# Altium schematic sheet SIT1051 CAN bus.SchDoc
size A4; SheetNumber: 12; SheetTotal: 12
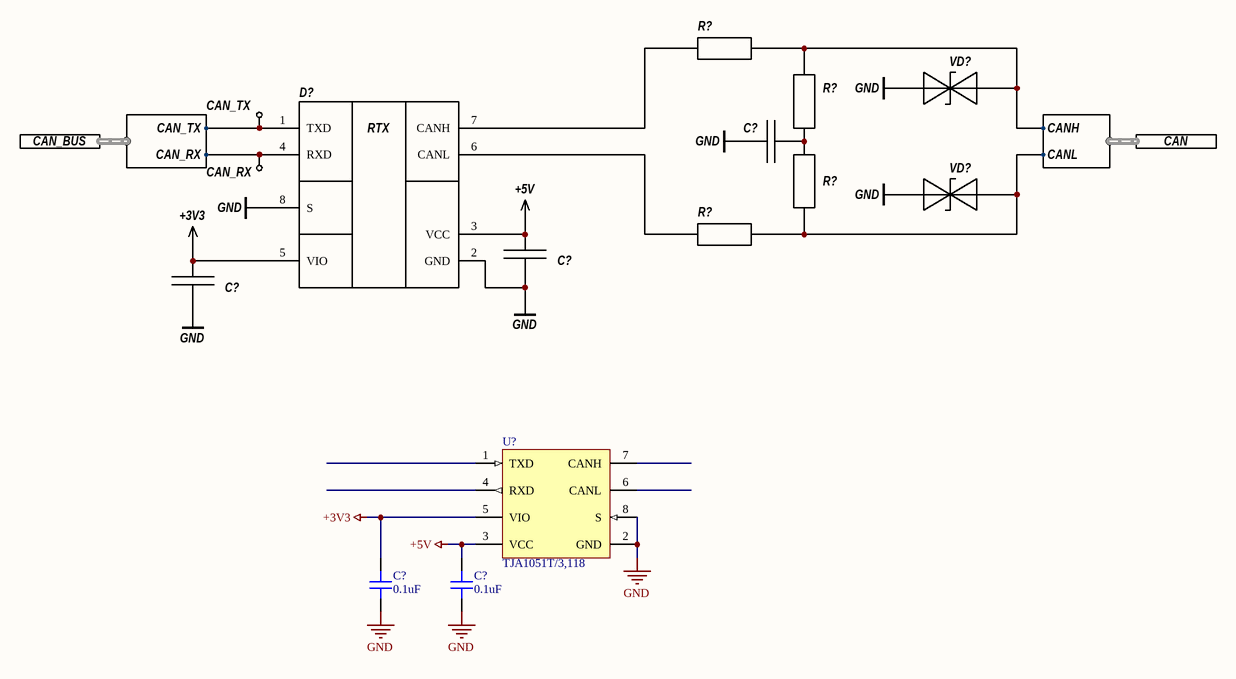
[diagram p0: SIT1051 CAN bus.SchDoc]

## Parts
(Parts that share a designator on the sheet are numbered #1, #2 ... from top to bottom, then left to right.)
C?#1  0.1uF  [C_0402]  (value not drawn)
C?#2  0.1uF  [C_0402]  (value not drawn)
C?#3  0.1uF  [C_0402]  (value not drawn)
C?#4  0.1uF  [CAPC1005X06N]
C?#5  0.1uF  [CAPC1005X06N]
D?  TCAN1051HVD  [SO_8_3p9_e1p27]  (value not drawn)
R?#1  10R  [R_0603]  (value not drawn)
R?#2  62R  [R_0603]  (value not drawn)
R?#3  62R  [R_0603]  (value not drawn)
R?#4  10R  [R_0603]  (value not drawn)
TP?#1  CAN_TX  [Via07_TEST]  (no BOM)
TP?#2  CAN_RX  [Via07_TEST]  (no BOM)
U?  TJA1051T/3,118  [NXP-SOIC-8_L]
VD?#1  SMAJ6,0CA-TR  [SMA]  (value not drawn)
VD?#2  SMAJ6,0CA-TR  [SMA]  (value not drawn)

## Ports
CAN (harness CANBUS), CAN_BUS (harness UART_CAN)

## Harnesses
CANBUS: CANL, CANH
UART_CAN: CAN_TX, CAN_RX

## Nets
+3V3: C?#3.2 C?#4.2 D?.5(VIO) U?.5(VIO)
+5V: C?#2.2 C?#5.2 D?.3(VCC) U?.3(VCC)
GND: C?#1.2 C?#2.1 C?#3.1 C?#4.1 C?#5.1 D?.2(GND) D?.8(S) U?.2(GND) U?.8(S) VD?#1.2 VD?#2.2
NetC?#1_1: C?#1.1 R?#2.1 R?#3.2
NetD?_1: D?.1(TXD) TP?#1.1 ; port CAN_BUS.CAN_TX
NetD?_4: D?.4(RXD) TP?#2.1 ; port CAN_BUS.CAN_RX
NetD?_6: D?.6(CANL) R?#4.1
NetD?_7: D?.7(CANH) R?#1.1
NetR?#1_2: R?#1.2 R?#2.2 VD?#1.1 ; port CAN.CANH
NetR?#3_1: R?#3.1 R?#4.2 VD?#2.1 ; port CAN.CANL

Not connected (* = marked no-connect by the designer): U? 1(TXD) 4(RXD) 6(CANL) 7(CANH)

## Notes on the sheet
- (in symbol Микросхема TCAN1051HVD) RTX

## Library data of the parts
C?#1-C?#3 = 0402-X7R-16V-0,1mkF ±10%: CAP CER 0.1UF 16V 10% X7R 0402; Manufacturer: Hitano Enterprise Co.; NameFromManufacturer: 0402B104K160NU; Place: S; Даташит: #\\svn-server\datasheets\Конденсаторы\TDK C Series.pdf#; Check: False; Склад ZIP: 9551937,87000000; Цена ZIP: 0,07029402; Статус ZIP: Действующее; Код SL: 301001004012925; Температура: 125°C; Part Number: 0402-X7R-16V-0,1mkF ±10%; Voltage: 16V; Tolerance: 10%; ComponentLink1URL: \\svn-server\datasheets\Конденсаторы\TDK C Series.pdf; ComponentLink1Description: DATASHEET; ComponentLink2Description: ТТ № 865; ComponentLink2URL: http://s01-3w01:19000/Kiep/documents/generalLists/_layouts/listform.aspx?PageType=4&ListId={72EB14B0-D142-4092-89FB-93824239B80E}&ID=872&ContentTypeID=0x01005F140719339A344182A674A570002819; Value: 0.1uF; ClassName: *
C?#4 C?#5 = 0402B104K500CT: Manufacturer: Walsin Tech Corp; Voltage: 50V; Tolerance: 10%; Dielectric: X7R; Min Temperature: -55; Max Temperature: 125; PartNumber: 0402B104K500CT; ComponentLink1URL: https://datasheet.lcsc.com/lcsc/1810191621_Walsin-Tech-Corp-0402B104K500CT_C152814.pdf; ComponentLink1Description: Datasheet; Package: 0402; Part Status: Active; Capacitance: 0.1uF
D? = Микросхема TCAN1051HVD: CAN Transceiver with CAN FD; NameFromManufacturer: TCAN1051HVD, TCAN1051HVDR; Manufacturer: Texas Instruments; Код SL: 301002007022973; Даташит: #\\svn-server\datasheets\Микросхемы\TCAN1051HVDR.pdf#; Rem: Добавлено 07.02.2020; Check: False; Склад ZIP: 839,00000000; Цена ZIP: 748,48363200; Статус ZIP: Действующее; Value: TCAN1051HVD; Part Number: Микросхема TCAN1051HVD; ComponentLink1URL: \\svn-server\datasheets\Микросхемы\TCAN1051HVDR.pdf; ComponentLink1Description: DATASHEET; ClassName: *
R?#1 R?#4 = 0603-0,1W-10R-200ppm ±5%: *; NameFromManufacturer: RC0603J10R; Manufacturer: Faithful Link; Place: S; Check: True; Склад ZIP: 1286706,00000000; Цена ZIP: 0,03280386; Статус ZIP: Действующее; Код SL: 301004032005538; Даташит: \\svn-server\datasheets\Резисторы\R_0603.pdf#\\svn-server\datasheets\Резисторы\R_0603.pdf#; Tolerance: 5%; Power: 0,1W; PPM: 200ppm; Part Number: 0603-0,1W-10R-200ppm ±5%; ComponentLink1Description: DATASHEET; ComponentLink1URL: \\svn-server\datasheets\Резисторы\R_0603.pdf; Value: 10R; ComponentLink2URL: http://s01-3w01:19000/Kiep/documents/generalLists/_layouts/listform.aspx?PageType=4&ListId={72EB14B0-D142-4092-89FB-93824239B80E}&ID=550&ContentTypeID=0x01005F140719339A344182A674A570002819; ComponentLink2Description: ТТ № 543
R?#2 R?#3 = 0603-0,1W-62R-200ppm ±5%: *; NameFromManufacturer: 9C06031A62R0JLHFT; Manufacturer: Phycomp; Place: S; Tolerance: 5%; Power: 0,1W; PPM: 200ppm; Check: False; Склад ZIP: 210426,00000000; Цена ZIP: 0,05042050; Статус ZIP: Действующее; Код SL: 301004032005888; Даташит: \\svn-server\datasheets\Резисторы\R_0603.pdf#\\svn-server\datasheets\Резисторы\R_0603.pdf#; Part Number: 0603-0,1W-62R-200ppm ±5%; ComponentLink1Description: DATASHEET; ComponentLink1URL: \\svn-server\datasheets\Резисторы\R_0603.pdf; ComponentLink2Description: ТТ № 543; ComponentLink2URL: http://s01-3w01:19000/Kiep/documents/generalLists/_layouts/listform.aspx?PageType=4&ListId={72EB14B0-D142-4092-89FB-93824239B80E}&ID=550&ContentTypeID=0x01005F140719339A344182A674A570002819; Value: 62R
TP?#1 TP?#2 = Переходное отв. с тестовой точкой: *; Value: VIA_Test; Даташит: #\\svn-server\datasheets\Технология\Требования к печатным платам изм6 проект 2 (2).doc#; Check: False; Склад ZIP: 0; Part Number: Переходное отв. с тестовой точкой; ComponentLink1URL: \\svn-server\datasheets\Технология\Требования к печатным платам изм6 проект 2 (2).doc; ComponentLink1Description: DATASHEET; Manufacturer: *; NameFromManufacturer: *; Цена ZIP: 0; Статус ZIP: *
U? = CMP-2000-07245-1: High-Speed CAN Transceiver, 3 to 5 V, 8-Pin SOIC (SOT96-1), RoHS, Tape and Reel; Manufacturer: NXP; Power Down Mode: Normal/Silent; Rad Hardened: No; Number of Transceivers: 1; Supply Current: 70mA; Operating Supply Voltage (Max): 5.5V; Operating Supply Voltage (Typ): 5V; Operating Supply Voltage (Min): 4.5V; Standard Supported: ISO11898-2; Data Rate: 1Mbps; DELETED: Compliant; Operating Temperature (Min): -40C; Datasheet Version: Rev. 7, 01/2015; Pin Count: 8; Operating Temperature (Max): 125C; Package Description: 8-Pin Small Outline Integrated Circuit, Body 4.9 x 3.9 mm, Pitch 1.27 mm; Category: Transceiver; Packaging: TapeandReel; Mounting: SurfaceMount; Package Reference: SOT96-1; Operating Temperature Classification: Automotive; Mounting Technology: SurfaceMount; Package Type: SO; Manufacturer URL: http://www.nxp.com/; Datasheet URL: http://www.nxp.com/documents/data_sheet/TJA1051.pdf
VD?#1 VD?#2 = Диод ограничительный SMAJ6,0CA-TR: TVS DIODE 6VWM 13.7VC SMA; Manufacturer: KLS Electronic Co., Ltd; Код SL: 301003010000369; Place: S; Даташит: \\Svn-server\datasheets\Диоды\SMAJ.pdf#\\Svn-server\datasheets\Диоды\SMAJ.pdf#; Check: True; Склад ZIP: 224751,00000000; Цена ZIP: 2,16248938; Статус ZIP: Действующее; Value: SMAJ6,0CA-TR; Part Number: Диод ограничительный SMAJ6,0CA-TR; ComponentLink1URL: \\Svn-server\datasheets\Диоды\SMAJ.pdf; ComponentLink1Description: DATASHEET; NameFromManufacturer: SMAJ6,0CA-TR; ClassName: *